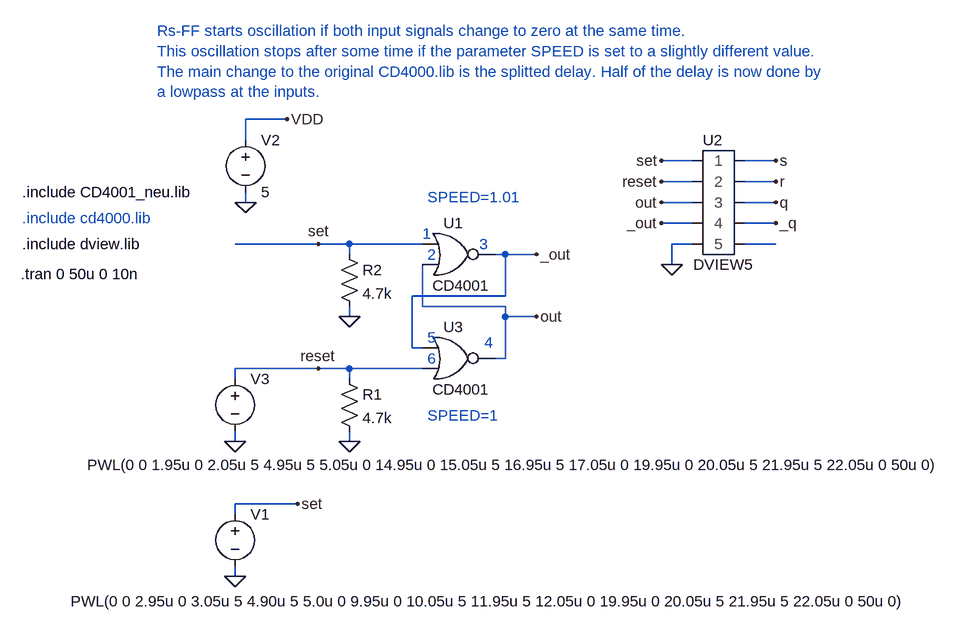
[diagram p0: schematic nor_gate_latch.asc]
nor_gate_latch.asc, the LTspice schematic file:
Version 4
SHEET 1 1772 1044
WIRE 16 144 16 208
WIRE 144 224 144 288
WIRE 144 128 144 192
WIRE 144 192 0 192
WIRE 0 192 0 272
WIRE 0 272 16 272
WIRE -96 208 -96 224
WIRE -96 400 -96 416
WIRE 144 224 192 224
WIRE -272 608 -272 624
WIRE -272 528 -272 512
WIRE -256 48 -256 32
WIRE -256 -48 -256 -80
WIRE -256 -80 -192 -80
WIRE -272 400 -272 416
WIRE -272 320 -272 304
WIRE 128 128 144 128
WIRE 128 288 144 288
WIRE -96 128 -96 112
WIRE -96 112 -144 112
WIRE 16 112 -96 112
WIRE -96 320 -96 304
WIRE -96 304 -144 304
WIRE 16 304 -96 304
WIRE 432 -16 384 -16
WIRE 432 16 384 16
WIRE 432 48 384 48
WIRE 432 80 384 80
WIRE 144 128 192 128
WIRE 512 -16 560 -16
WIRE 512 16 560 16
WIRE 512 48 560 48
WIRE 512 80 560 80
WIRE -144 112 -272 112
WIRE -144 304 -272 304
WIRE 432 112 400 112
WIRE 400 112 400 144
WIRE 144 224 144 208
WIRE 144 208 16 208
WIRE -272 512 -176 512
WIRE 512 112 560 112
FLAG -96 224 0
FLAG -96 416 0
FLAG -272 624 0
FLAG -256 48 0
FLAG -192 -80 VDD
FLAG -272 416 0
FLAG 192 224 out
FLAG 384 -16 set
FLAG 384 16 reset
FLAG 384 48 out
FLAG 384 80 _out
FLAG 192 128 _out
FLAG 560 -16 s
FLAG 560 16 r
FLAG 560 48 q
FLAG 560 80 _q
FLAG -144 112 set
FLAG -144 304 reset
FLAG 400 144 0
FLAG -176 512 set
SYMBOL res -112 304 R0
SYMATTR InstName R1
SYMATTR Value 4.7k
SYMBOL res -112 112 R0
SYMATTR InstName R2
SYMATTR Value 4.7k
SYMBOL voltage -272 512 R0
WINDOW 3 -253 150 Left 0
WINDOW 123 0 0 Left 0
WINDOW 39 0 0 Left 0
SYMATTR Value PWL(0 0 2.95u 0 3.05u 5 4.90u 5 5.0u 0 9.95u 0 10.05u 5 11.95u 5 12.05u 0 19.95u 0 20.05u 5 21.95u 5 22.05u 0 50u 0)
SYMATTR InstName V1
SYMBOL voltage -256 -64 R0
SYMATTR InstName V2
SYMATTR Value 5
SYMBOL voltage -272 304 R0
WINDOW 3 -228 148 Left 0
WINDOW 123 0 0 Left 0
WINDOW 39 0 0 Left 0
SYMATTR Value PWL(0 0 1.95u 0 2.05u 5 4.95u 5 5.05u 0 14.95u 0 15.05u 5 16.95u 5 17.05u 0 19.95u 0 20.05u 5 21.95u 5 22.05u 0 50u 0)
SYMATTR InstName V3
SYMBOL C:\\WUTemp\\CD4000\\dview5 448 128 R0
SYMATTR InstName U2
SYMBOL C:\\WUTemp\\CD4000\\CD4001B 64 64 R0
SYMATTR InstName U1
SYMATTR SpiceLine VDD=5  SPEED=1.01  TRIPDT=5e-9
SYMATTR Value CD4001
SYMBOL C:\\WUTemp\\CD4000\\CD4001B 64 224 R0
SYMATTR InstName U3
SYMATTR Value CD4001
TEXT -602 158 Left 0 !.tran 0 50u 0 10n
TEXT -600 72 Left 0 ;.include cd4000.lib
TEXT -600 112 Left 0 !.include dview.lib
TEXT 16 96 Left 0 ;1
TEXT 24 128 Left 0 ;2
TEXT 104 112 Left 0 ;3
TEXT 112 264 Left 0 ;4
TEXT 24 256 Left 0 ;5
TEXT 24 288 Left 0 ;6
TEXT 24 40 Left 0 ;SPEED=1.01
TEXT 24 376 Left 0 ;SPEED=1
TEXT -600 32 Left 0 !.include CD4001_neu.lib
TEXT -392 -216 Left 0 ;Rs-FF starts oscillation if both input signals change to zero at the same time.\nThis oscillation stops after some time if the parameter SPEED is set to a slightly different value.\nThe main change to the original CD4000.lib is the splitted delay. Half of the delay is now done by \na lowpass at the inputs.

The netlist it stands for:
* nor_gate_latch.asc
R1 reset 0 4.7k
R2 set 0 4.7k
V1 set 0 PWL(0 0 2.95u 0 3.05u 5 4.90u 5 5.0u 0 9.95u 0 10.05u 5 11.95u 5 12.05u 0 19.95u 0 20.05u 5 21.95u 5 22.05u 0 50u 0)
V2 VDD 0 5
V3 reset 0 PWL(0 0 1.95u 0 2.05u 5 4.95u 5 5.05u 0 14.95u 0 15.05u 5 16.95u 5 17.05u 0 19.95u 0 20.05u 5 21.95u 5 22.05u 0 50u 0)
XU2 set s reset r out q _out _q 0 N001 DVIEW5 OFFSET=0  GAIN=0.1  ; pins i1 o1 i2 o2 i3 o3 i4 o4 i5 o5
XU1 set out _out VDD 0 CD4001 VDD=5  SPEED=1.01  TRIPDT=5e-9  ; pins A B Y
XU3 _out reset out VDD 0 CD4001 VDD=5  SPEED=1.0  TRIPDT=5e-9  ; pins A B Y
.tran 0 50u 0 10n
* .include cd4000.lib
.include dview.lib
* 1
* 2
* 3
* 4
* 5
* 6
* SPEED=1.01
* SPEED=1
.include CD4001_neu.lib
* Rs-FF starts oscillation if both input signals change to zero at the same time.
* This oscillation stops after some time if the parameter SPEED is set to a slightly different value.
* The main change to the original CD4000.lib is the splitted delay. Half of the delay is now done by
* a lowpass at the inputs.
.backanno
.end